# EAGLE schematic ardtweeno-movement-sensor-platform (EAGLE 6.4)
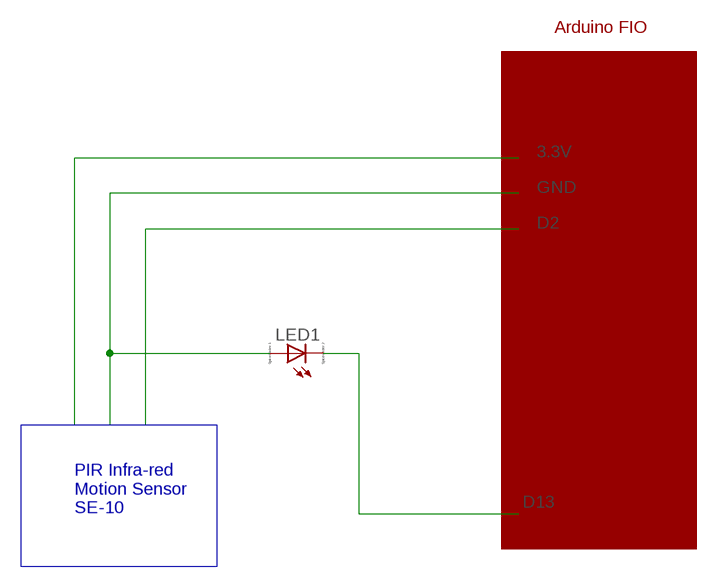
[diagram p0: schematic, sheet 1]

## Parts
LED1  LED_E  [LED_1206]

## Nets
D13: LED1.C
GND: LED1.A

## Buses
B$1

## Notes on the sheet
- Arduino FIO
- PIR Infra-red
  Motion Sensor
  SE-10

## Library data of the parts
LED1 = eagle-ltspice:LED_E: LED Source: http://www.osram.convergy.de Source: www.luxeon.com Source: www.kingbright.com; SPICEMODEL: NONE; SPICEPREFIX: D; SPICETYPE: diode